# EAGLE design Arturo_Eagle_7_X (EAGLE 7.6.0)
Circuito Anti-jammer
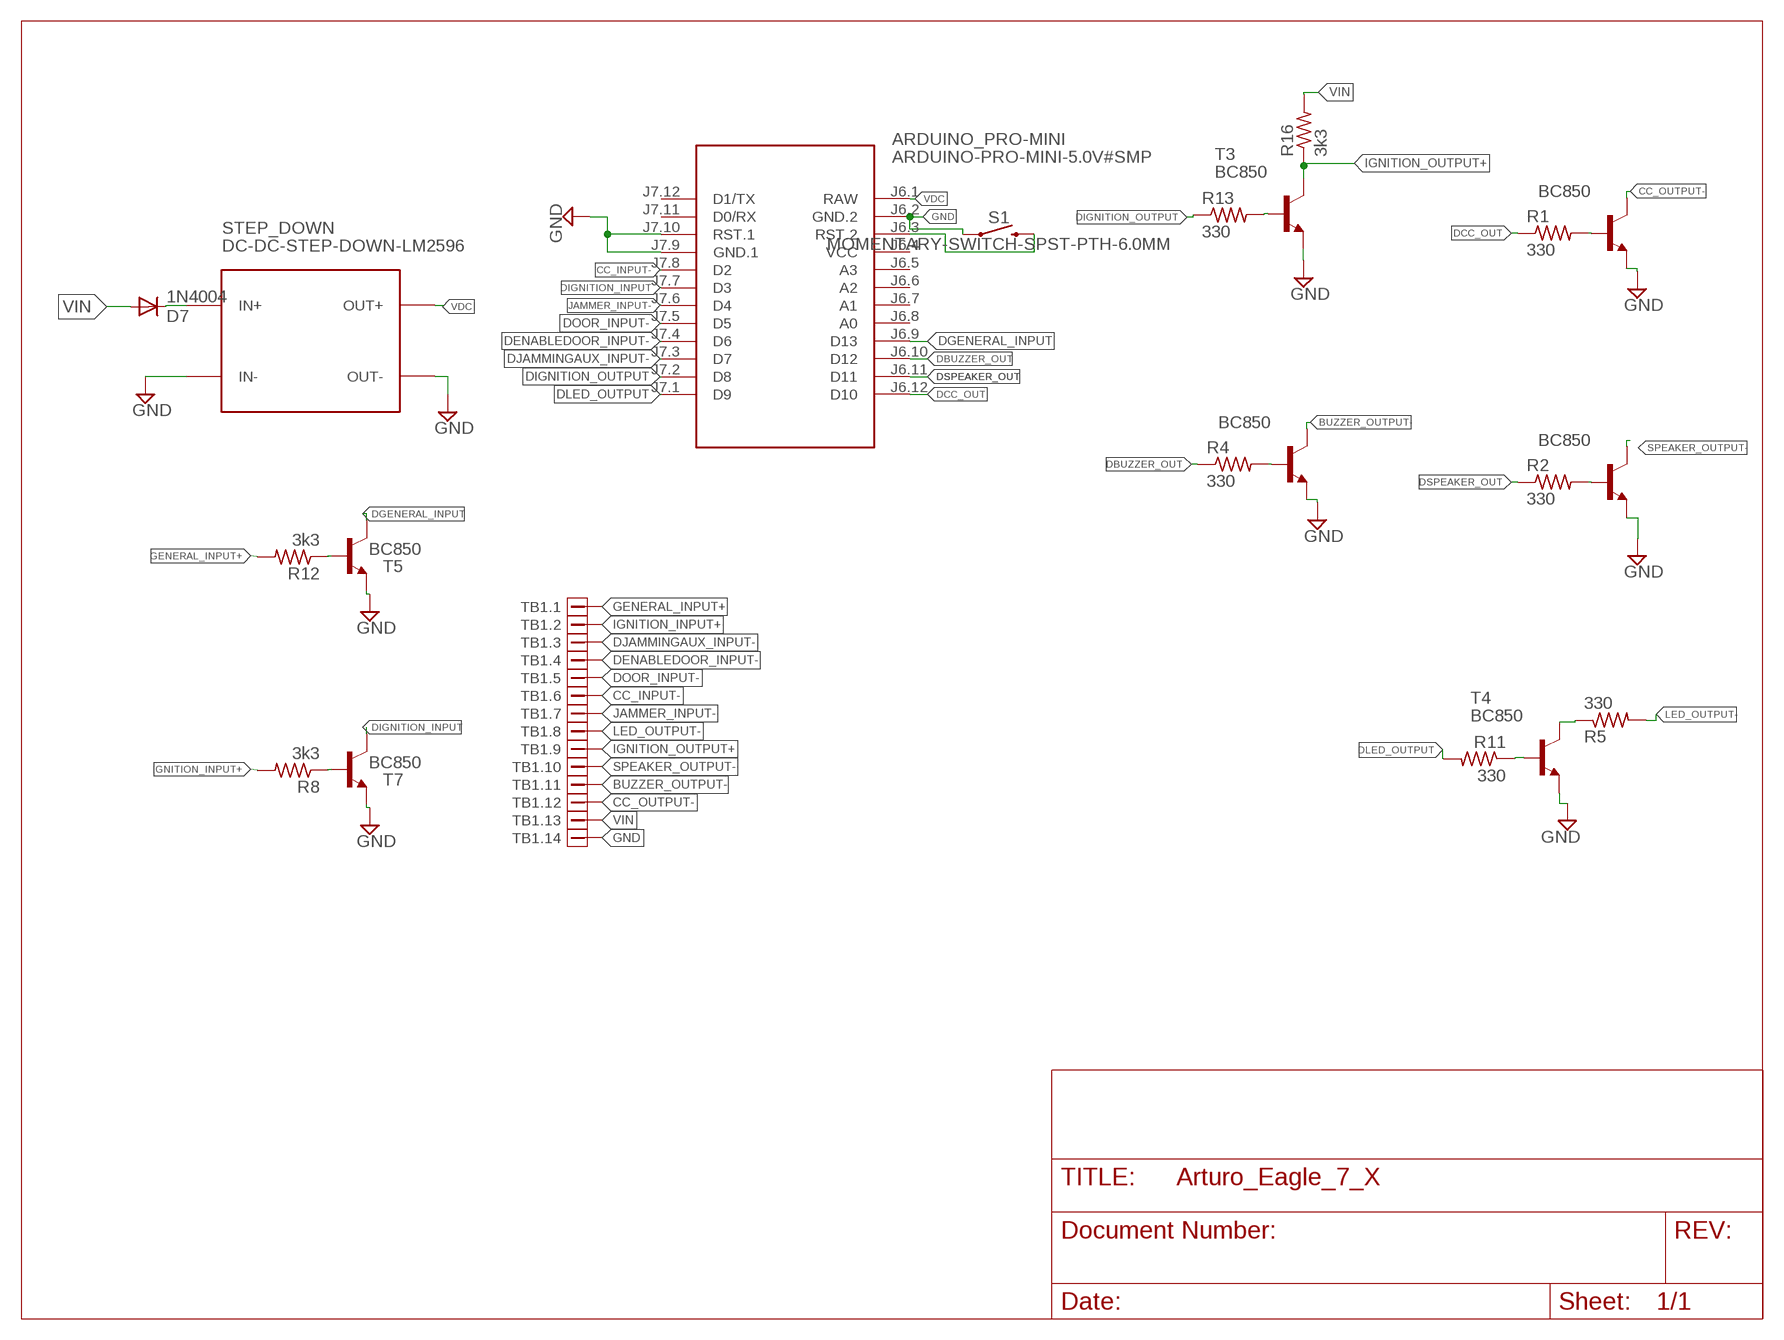
[diagram p0: schematic, sheet 1]

## Parts
ARDUINO_PRO-MINI  ARDUINO-PRO-MINI-5.0V#SMP  [ARDUINO-PRO-MINI#SMP]
D7  1N4004  [DO41-10]
R1  330  R-US_R0805  [R0805]
R2  330  R-US_R0805  [R0805]
R4  330  R-US_R0805  [R0805]
R5  330  R-US_R0805  [R0805]
R8  3k3  R-US_R0805  [R0805]
R11  330  R-US_R0805  [R0805]
R12  3k3  R-US_R0805  [R0805]
R13  330  R-US_R0805  [R0805]
R16  3k3  R-US_R0805  [R0805]
S1  MOMENTARY-SWITCH-SPST-PTH-6.0MM  [TACTILE_SWITCH_PTH_6.0MM]
STEP_DOWN  DC-DC-STEP-DOWN-LM2596  [DC-DC-STEP-DOWN-LM2596]
T1  BC850  [SOT23]
T3  BC850  [SOT23]
T4  BC850  [SOT23]
T5  BC850  [SOT23]
T6  BC850  [SOT23]
T7  BC850  [SOT23]
T8  BC850  [SOT23]
TB1  TB_PHOENIX  [TERMINAL_BLOCK_14POS]

## Nets
BUZZER_OUTPUT-: T6.3(C) TB1.11 TB1.25
CC_INPUT-: ARDUINO_PRO-MINI.J7.8(D2) TB1.6 TB1.20
CC_OUTPUT-: T8.3(C) TB1.12 TB1.26
DBUZZER_OUT: ARDUINO_PRO-MINI.J6.10(D12) R4.1
DCC_OUT: ARDUINO_PRO-MINI.J6.12(D10) R1.1
DENABLEDOOR_INPUT-: ARDUINO_PRO-MINI.J7.4(D6) TB1.4 TB1.18
DGENERAL_INPUT: ARDUINO_PRO-MINI.J6.9(D13) T5.3(C)
DIGNITION_INPUT: ARDUINO_PRO-MINI.J7.7(D3) T7.3(C)
DIGNITION_OUTPUT: ARDUINO_PRO-MINI.J7.2(D8) R13.1
DJAMMINGAUX_INPUT-: ARDUINO_PRO-MINI.J7.3(D7) TB1.3 TB1.17
DLED_OUTPUT: ARDUINO_PRO-MINI.J7.1(D9) R11.2
DOOR_INPUT-: ARDUINO_PRO-MINI.J7.5(D5) TB1.5 TB1.19
DSPEAKER_OUT: ARDUINO_PRO-MINI.J6.11(D11) R2.1
GENERAL_INPUT+: R12.2 TB1.1 TB1.15
GND: ARDUINO_PRO-MINI.J6.2(GND.2) ARDUINO_PRO-MINI.J7.9(GND.1) ARDUINO_PRO-MINI.J7.10(RST.1) S1.1 STEP_DOWN.IN- STEP_DOWN.OUT- T1.2(E) T3.2(E) T4.2(E) T5.2(E) T6.2(E) T7.2(E) T8.2(E) TB1.14 TB1.28
IGNITION_INPUT+: R8.2 TB1.2 TB1.16
IGNITION_OUTPUT+: R16.1 T3.3(C) TB1.9 TB1.23
JAMMER_INPUT-: ARDUINO_PRO-MINI.J7.6(D4) TB1.7 TB1.21
LED_OUTPUT-: R5.2 TB1.8 TB1.22
N$1: R12.1 T5.1(B)
N$2: R13.2 T3.1(B)
N$3: R1.2 T8.1(B)
N$4: R2.2 T1.1(B)
N$5: R4.2 T6.1(B)
N$6: R5.1 T4.3(C)
N$10: ARDUINO_PRO-MINI.J6.3(RST.2) S1.3
N$20: R11.1 T4.1(B)
N$22: R8.1 T7.1(B)
N$23: D7.C STEP_DOWN.IN+
SPEAKER_OUTPUT-: T1.3(C) TB1.10 TB1.24
VDC: ARDUINO_PRO-MINI.J6.1(RAW) STEP_DOWN.OUT+
VIN: D7.A R16.2 TB1.13 TB1.27
Unconnected: ARDUINO_PRO-MINI.J6.5(A3) ARDUINO_PRO-MINI.J6.6(A2) ARDUINO_PRO-MINI.J6.7(A1) ARDUINO_PRO-MINI.J6.8(A0) ARDUINO_PRO-MINI.J7.11(D0/RX) ARDUINO_PRO-MINI.J7.12(D1/TX)

## Power pins joined to a net without a drawn wire
VCC: ARDUINO_PRO-MINI.J6.4(VCC)

## Library data of the parts
ARDUINO_PRO-MINI = diy-modules:ARDUINO-PRO-MINI-*#SMP: Arduino Pro Mini (and compatible devices) with 2 connectors only More details available here: https://www.arduino.cc/en/Main/ArduinoBoardProMini Click here to find device on ebay.com <http://www.ebay.com/sch/arduino+pro+mini>
D7 = diode:1N4004: DIODE general purpose rectifier, 1 A
R1 R2 R4 R5 R8 R11-R13 R16 = resistor:R-US_: RESISTOR, American symbol
S1 = SparkFun-Switches:MOMENTARY-SWITCH-SPST: Momentary Switch (Pushbutton) - SPST Normally-open (NO) SPST momentary switches (buttons, pushbuttons). Variants PTH-12MM - 12mm square, through-hole Momentary Pushbutton Switch - 12mm Square <https://www.sparkfun.com/products/9190> (COM-09190) PTH-6.0MM, PTH-6.0MM-KIT - 6.0mm square, through-hole Mini Pushbutton Switch <https://www.sparkfun.com/products/97> (COM-00097) KIT package intended for soldering kit's - only one side of pads' copper is exposed. PTH-RIGHT-ANGLE-KIT - Right-angle, through-hole Right Angle Tactile Button <https://www.sparkfun.com/products/10791> - Used on SparkFun BigTime Watch Kit <https://www.sparkfun.com/products/11734> SMD-12MM - 12mm square, surface-mount Tactile Button - SMD (12mm) <https://www.sparkfun.com/products/12993> (COM-12993) Used on SparkFun PicoBoard <https://www.sparkfun.com/products/11888> SMD-4.5MM - 4.5mm Square Trackball Switch Used on SparkFun Blackberry Trackballer Breakout <https://www.sparkfun.com/products/13169> SMD-4.6MMX2.8MM - 4.60mm x 2.80mm, surface mount Used on SparkFun SAMD21 Mini Breakout <https://www.sparkfun.com/products/13664> SMD-5.2MM, SMD-5.2-REDUNDANT - 5.2mm square, surface-mount Mini Pushbutton Switch - SMD <https://www.sparkfun.com/products/8720> (COM-08720) Used on Arduino Pro Mini <https://www.sparkfun.com/products/11114> REDUNDANT package connects both switch circuits together SMD-6.0X3.5MM - 6.0 x 3.5mm, surface mount Momentary Reset Switch SMD <https://www.sparkfun.com/products/8229> (COM-08229) SMD-6.2MM-TALL - 6.2mm square, surface mount Tactile Button - SMD (6mm) <https://www.sparkfun.com/products/12992> Used on SparkFun Digital Sandbox <https://www.sparkfun.com/products/12651> SMD-RIGHT-ANGLE - Right-angle, surface mount Used on SparkFun Block for Intel® Edison - Arduino <https://www.sparkfun.com/products/13036>; PROD_ID: SWCH-08441; SF_SKU: COM-00097
STEP_DOWN = diy-modules:DC-DC-STEP-DOWN-LM2596: DC/DC Step-Down Regulator based on LM2596-ADJ chip LM2596 datasheet available here: http://www.ti.com/lit/ds/symlink/lm2596.pdf Click here to find device on ebay.com <http://www.ebay.com/sch/lm2596+power+regulator>
T1 T3-T8 = transistor:BC850: NPN TRANSISTOR
TB1 = libreria_PCB_Arturo:TB_PHOENIX

## Board
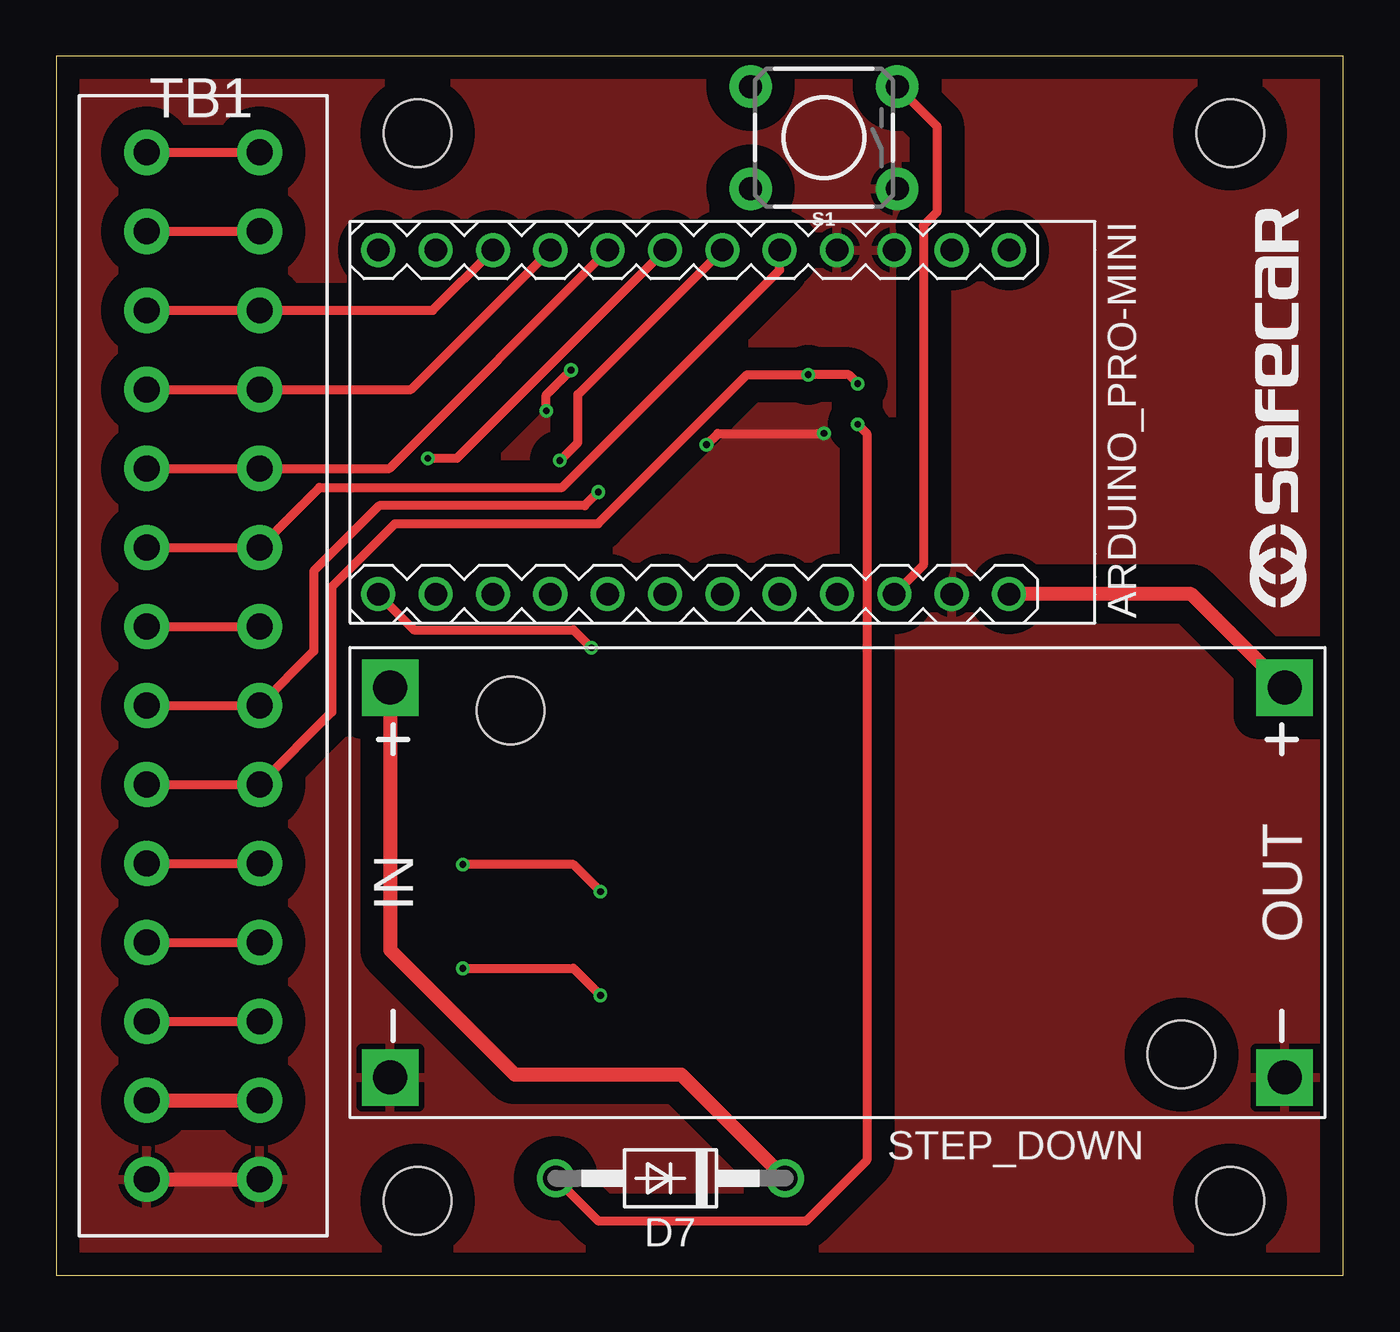
[diagram p1: board, top side]
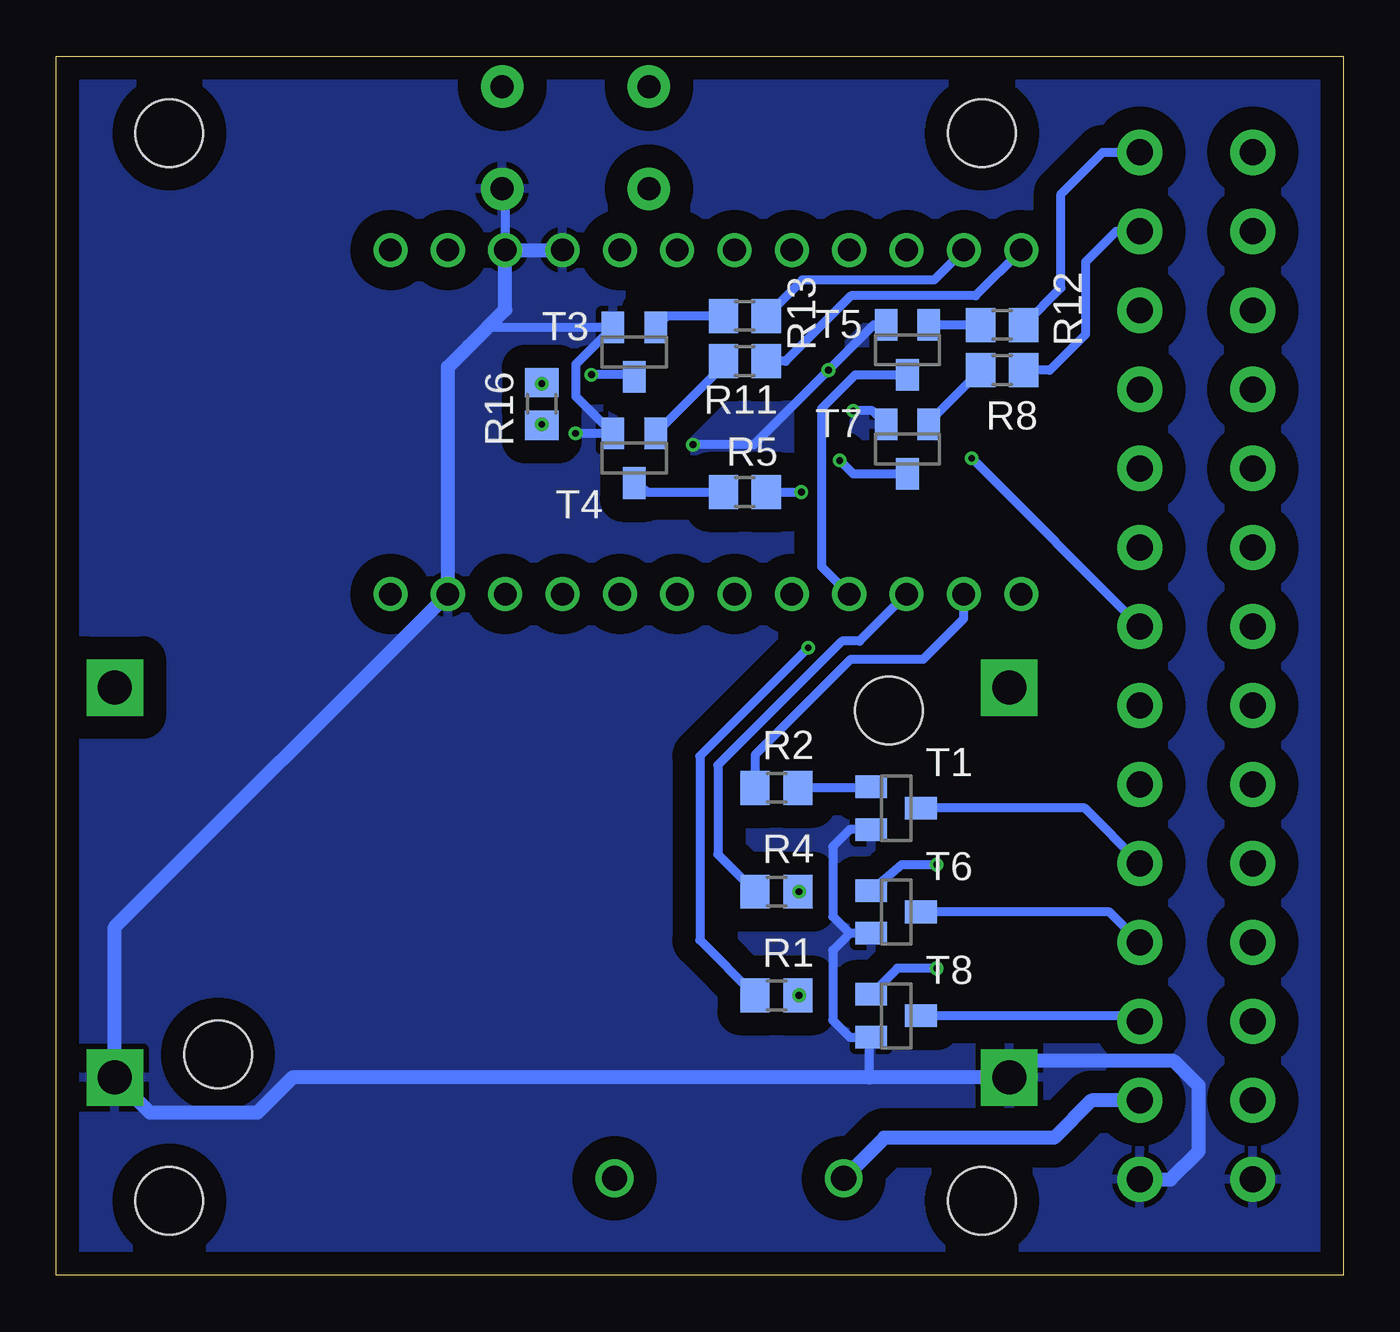
[diagram p2: board, bottom side, seen from below]

Size 57 x 54 mm. Coordinates in mm from the lower left corner, seen from the top.
Outline: 0,0 57,0 57,54 0,54 0,0
Copper layers (1*16): Top 0.035mm / dielectric 1.5mm / Bottom 0.035mm
Design rules "Reglas Eagle *": minimum track width 6mil, minimum drill 10mil, track to track 6mil, track to pad 6mil, pad to pad 6mil, via to via 6mil, smd to smd 0mil, copper to edge 10mil, drill to drill 10mil, minimum pad ring 10mil, minimum via ring 6mil, stop-mask expansion 2mil, vias tented up to drill 100mil, thermal gap 10mil
Holes 3 mm at 16,3.3 52,3.3 52,50.6 16,50.6

### Footprints (pad centres in the part's own frame; a part is rotated, then mirrored left to right if it is on the bottom)
ARDUINO-PRO-MINI#SMP = drill 1: J6.1 -12.7,7.62; J6.2 -10.16,7.62; J6.3 -7.62,7.62; J6.4 -5.08,7.62; J6.5 -2.54,7.62; J6.6 0,7.62; J6.7 2.54,7.62; J6.8 5.08,7.62; J6.9 7.62,7.62; J6.10 10.16,7.62; J6.11 12.7,7.62; J6.12 15.24,7.62; J7.1 15.24,-7.62; J7.2 12.7,-7.62; J7.3 10.16,-7.62; J7.4 7.62,-7.62; J7.5 5.08,-7.62; J7.6 2.54,-7.62; J7.7 0,-7.62; J7.8 -2.54,-7.62; J7.9 -5.08,-7.62; J7.10 -7.62,-7.62; J7.11 -10.16,-7.62; J7.12 -12.7,-7.62
DO41-10 = drill 1.118: A 5.08,0; C -5.08,0
R0805 = smd 1.3 x 1.5: 1 -0.95,0; 2 0.95,0
TACTILE_SWITCH_PTH_6.0MM = drill 1.016 pad 1.88: 1 -3.251,2.261; 2 3.251,2.261; 3 -3.251,-2.261; 4 3.251,-2.261
DC-DC-STEP-DOWN-LM2596 = drill 1.5 pad 2.5 square: IN+ -19.812,8.636; IN- -19.812,-8.636; OUT+ 19.812,8.636; OUT- 19.812,-8.636 | hole 3: -14.478,7.62; 15.24,-7.62
SOT23 = smd 1 x 1.4: 1 -0.95,-1.1; 2 0.95,-1.1; 3 0,1.1
TERMINAL_BLOCK_14POS = drill 1.15 pad 2: 1 -22.75,2.5; 2 -19.25,2.5; 3 -15.75,2.5; 4 -12.25,2.5; 5 -8.75,2.5; 6 -5.25,2.5; 7 -1.75,2.5; 8 1.75,2.5; 9 5.25,2.5; 10 8.75,2.5; 11 12.25,2.5; 12 15.75,2.5; 13 19.25,2.5; 14 22.75,2.5; 15 -22.75,-2.5; 16 -19.25,-2.5; 17 -15.75,-2.5; 18 -12.25,-2.5; 19 -8.75,-2.5; 20 -5.25,-2.5; 21 -1.75,-2.5; 22 1.75,-2.5; 23 5.25,-2.5; 24 8.75,-2.5; 25 12.25,-2.5; 26 15.75,-2.5; 27 19.25,-2.5; 28 22.75,-2.5

### Placement (x,y rotation side)
ARDUINO_PRO-MINI  29.5,37.8 180 top
D7  27.2,4.3 180 top
R1  25.1,12.4 0 bottom
R2  25.1,21.6 0 bottom
R4  25.1,17 0 bottom
R5  26.5,34.7 0 bottom
R8  15.1,40.1 0 bottom
R11  26.5,40.5 0 bottom
R12  15.1,42.1 0 bottom
R13  26.5,42.5 180 bottom
R16  35.5,38.6 270 bottom
S1  34,50.4 180 top
STEP_DOWN  34.6,17.4 0 top
T1  19.8,20.7 270 bottom
T3  31.4,40.9 180 bottom
T4  31.4,36.2 180 bottom
T5  19.3,41 180 bottom
T6  19.8,16.1 270 bottom
T7  19.3,36.6 180 bottom
T8  19.8,11.5 270 bottom
TB1  6.5,27 270 top

### Tracks (layer width: path | path; a pad name or v marks a point on that pad's centre or on a via)
BUZZER_OUTPUT-
  Top 0.406: TB1.25 TB1.11
  Bottom 0.406: TB1.11 10.35,16.1 T6.3
CC_INPUT-
  Top 0.406: TB1.20 TB1.6 11.65,34.9 22.4,34.9 32.04,44.54 ARDUINO_PRO-MINI.J7.8
CC_OUTPUT-
  Top 0.406: TB1.26 TB1.12
  Bottom 0.406: TB1.12 9.25,11.5 T8.3
DBUZZER_OUT
  Bottom 0.406: R4.1 27.7,18.65 27.7,22.6 22.2,28.1 21.42,28.1 ARDUINO_PRO-MINI.J6.10
DCC_OUT  (via drill 0.3)
  Top 0.406: ARDUINO_PRO-MINI.J6.12 15.84,28.6 22.9,28.6 v23.7,27.8
  Bottom 0.406: v23.7,27.8 28.5,23 28.5,14.85 R1.1
DENABLEDOOR_INPUT-
  Top 0.406: TB1.18 TB1.4 15.71,39.25 ARDUINO_PRO-MINI.J7.4
DGENERAL_INPUT
  Bottom 0.406: T5.3 21.6,39.9 23.1,38.4 23.1,31.4 ARDUINO_PRO-MINI.J6.9
DIGNITION_INPUT  (via drill 0.3)
  Top 0.406: v22.3,36.1 23.1,36.9 23.1,39.02 ARDUINO_PRO-MINI.J7.7
  Bottom 0.406: T7.3 21.7,35.5 v22.3,36.1
DIGNITION_OUTPUT
  Bottom 0.406: ARDUINO_PRO-MINI.J7.2 18.12,44.1 23.95,44.1 R13.1
DJAMMINGAUX_INPUT-
  Top 0.406: TB1.17 TB1.3 16.67,42.75 ARDUINO_PRO-MINI.J7.3
DLED_OUTPUT
  Bottom 0.406: ARDUINO_PRO-MINI.J7.1 16.28,43.4 21.8,43.4 24.7,40.5 R11.2
DOOR_INPUT-
  Top 0.406: TB1.19 TB1.5 14.75,35.75 ARDUINO_PRO-MINI.J7.5
DSPEAKER_OUT
  Bottom 0.406: ARDUINO_PRO-MINI.J6.11 16.8,29.1 18.6,27.3 21.8,27.3 26.05,23.05 R2.1
GENERAL_INPUT+
  Top 0.406: TB1.15 TB1.1
  Bottom 0.406: TB1.1 10.65,49.75 12.5,47.9 12.5,43.75 R12.2
GND  (via drill 0.3)
  Top 0.406: v21.7,38.3 21.7,39 v22.8,40.1 | v28.8,36.8 29.3,37.3 v34,37.3
  Top 0.61: TB1.28 TB1.14
  Bottom 0.406: v34,37.3 T4.2 34,38.95 34,40.35 T3.2 37.9,42 38.75,41.15 | T1.2 21.85,19.75 22.6,19 22.6,15.9 21.85,15.15 | S1.1 37.12,48.01 ARDUINO_PRO-MINI.J7.10 | T5.2 20.8,42.1 v22.8,40.1 26.1,36.8 v28.8,36.8 | T7.2 20.85,38.3 v21.7,38.3 | 21,8.76 21,10.45 T8.2 21.85,10.55 22.6,11.3 22.6,14.4 21.85,15.15 | T6.2 21.85,15.15
  Bottom 0.61: TB1.14 7.65,4.25 6.4,5.5 6.4,8.4 7.5,9.5 14.05,9.5 STEP_DOWN.IN- 21,8.76 46.54,8.76 48.1,7.2 52.85,7.2 STEP_DOWN.OUT- 54.41,15.43 ARDUINO_PRO-MINI.J6.2 39.66,40.24 38.75,41.15 37.12,42.78 ARDUINO_PRO-MINI.J7.10 ARDUINO_PRO-MINI.J7.9
  pour Bottom (isolate 1.016): 0,0 0,54 57,54 57,0
  pour Top (isolate 1.016): 0,0 0,54 57,54 57,0
IGNITION_INPUT+
  Top 0.406: TB1.16 TB1.2
  Bottom 0.406: TB1.2 10.05,46.25 11.4,44.9 11.4,41.7 13,40.1 R8.2
IGNITION_OUTPUT+  (via drill 0.3)
  Top 0.406: TB1.23 TB1.9 12.2,24.95 12.2,30.5 15,33.3 24,33.3 30.6,39.9 v33.3,39.9 35.1,39.9 v35.5,39.5
  Bottom 0.406: T3.3 31.5,39.9 v33.3,39.9 | R16.1 v35.5,39.5
JAMMER_INPUT-  (via drill 0.3)
  Top 0.406: TB1.21 TB1.7 | v16.45,36.2 17.74,36.2 ARDUINO_PRO-MINI.J7.6
  Bottom 0.406: TB1.7 v16.45,36.2
LED_OUTPUT-  (via drill 0.3)
  Top 0.406: TB1.22 TB1.8 11.4,27.65 11.4,31.2 14.3,34.1 23.4,34.1 v24,34.7
  Bottom 0.406: R5.2 v24,34.7
N$1
  Bottom 0.406: R12.1 T5.1
N$2
  Bottom 0.406: R13.2 29.95,42.5 T3.1
N$3  (via drill 0.3, 0.3 pad 0.41)
  Top 0.406: v18,13.6 22.9,13.6 v24.1,12.4
  Bottom 0.406: R1.2 v24.1,12.4 | v18,13.6 19.75,13.6 T8.1
N$4
  Bottom 0.406: T1.1 20.95,21.6 R2.2
N$5  (via drill 0.3, 0.3 pad 0.41)
  Top 0.406: v24.1,17 22.9,18.2 v18,18.2
  Bottom 0.406: v18,18.2 19.55,18.2 T6.1 | R4.2 v24.1,17
N$6
  Bottom 0.406: T4.3 30.8,34.7 R5.1
N$10
  Top 0.406: ARDUINO_PRO-MINI.J6.3 38.4,31.46 38.4,46.5 39,47.1 39,50.91 S1.3
N$20
  Bottom 0.406: R11.1 27.45,40.3 T4.1
N$22
  Bottom 0.406: R8.1 18.35,37.8 T7.1
N$23
  Top 0.61: STEP_DOWN.IN+ 14.79,14.41 20.3,8.9 27.68,8.9 D7.C
SPEAKER_OUTPUT-
  Top 0.406: TB1.24 TB1.10
  Bottom 0.406: TB1.10 11.45,20.7 T1.3
VDC
  Top 0.61: STEP_DOWN.OUT+ 50.27,30.18 ARDUINO_PRO-MINI.J6.1
VIN  (via drill 0.3 pad 0.41)
  Top 0.406: v35.5,37.7 35.9,37.3 35.9,5.1 33.2,2.4 24.02,2.4 D7.A
  Top 0.61: TB1.27 TB1.13
  Bottom 0.406: R16.2 v35.5,37.7
  Bottom 0.61: TB1.13 11.15,7.75 12.8,6.1 20.32,6.1 D7.A

### Text on the board
tPlace: C:/Users/Tomy/Desktop/tomas/Trabajos Varios/PCB_ArturoVeras/logo negro.bmp